# Altium schematic sheet Control_Sense_BOTTMOS V2.SchDoc (part 3 of 3)
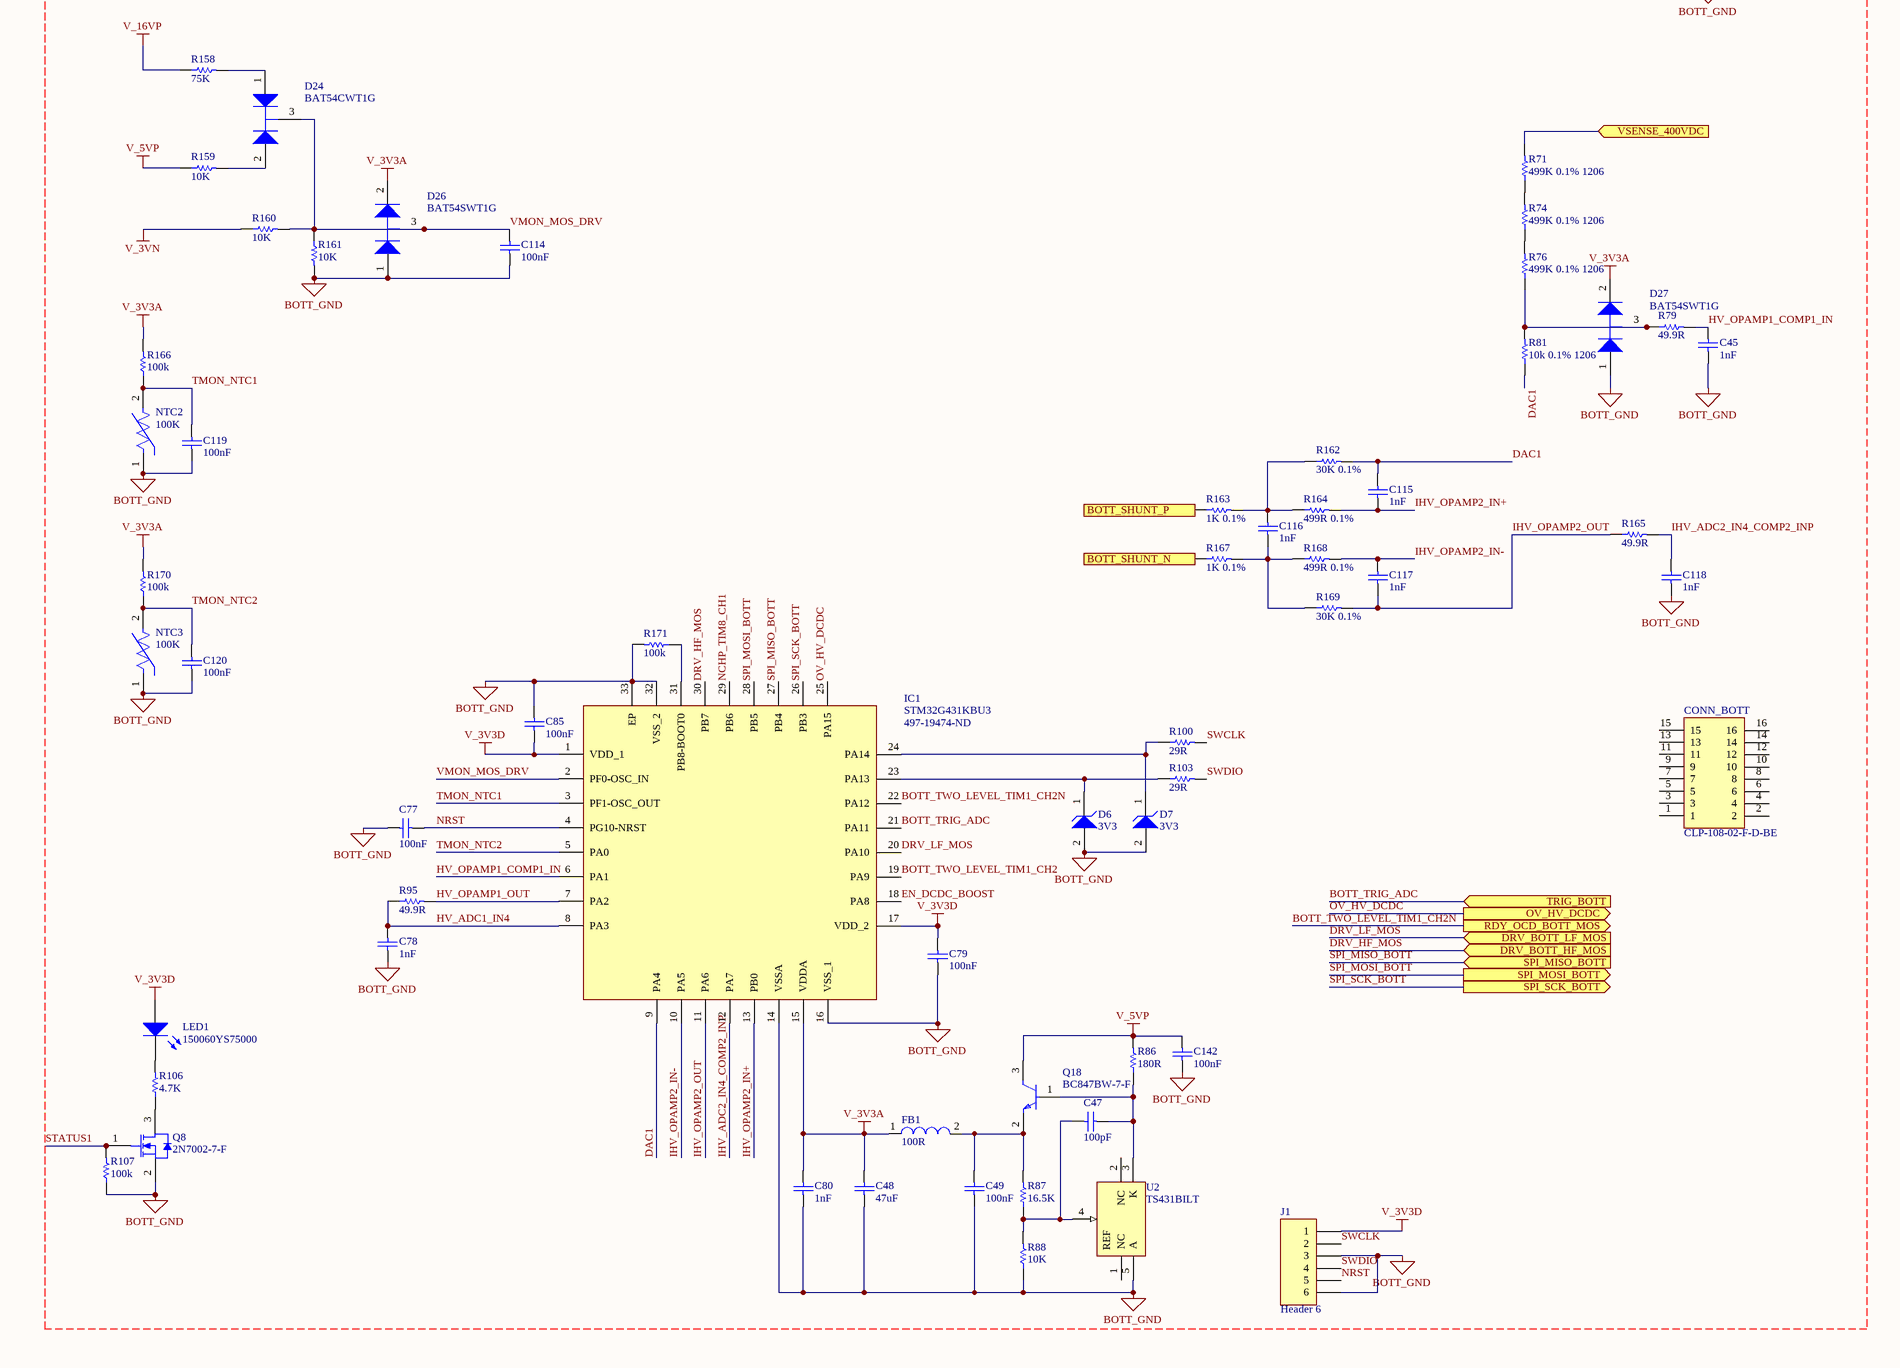
[diagram p3: Control_Sense_BOTTMOS V2.SchDoc, bottom]

## Library data of the parts (continued)
R71 R74 R76 = CMP-2003-02605-1: RES SMD 499K OHM 0.1% 1/4W 1206; Manufacturer: Susumu; Part Number: RG3216P-4993-B-T1; Resistance: 499kR; Temperature Coefficient: 25ppm/°C; Power Rating: 125mW; Voltage Rating: 150V; Max Power Dissipation: 250mW; Voltage Rating (DC): 200V; Supplier 1: Digi-Key; Supplier Part Number 1: RG32P499KBCT-ND; Manufacturer Part Number: RG3216P-4993-B-T1; RoHS: Yes; Category: Chip SMD Resistors; Stock 1: 248102; Pricing 1: 1=0.59000, 10=0.42000, 100=0.21840 (USD); Case/Package: 1206; Number of Pins: 2; Case Code (Imperial): 1206; Case Code (Metric): 3216; Min Operating Temperature: -55°C; Max Operating Temperature: 155°C; Tolerance: 0.1%; Packaging: Tape and Reel; Resistor Type: Thin Film; Package Quantity: 1; Number of Terminations: 2; Series: RG; Termination: SMD/SMT; Features: Automotive AEC-Q200; Length: 0.126inch; Width: 1.6mm; Height: 0.02inch; RoHS Compliant: Yes; Lead Free: Lead Free; ComponentLink1URL: https://datasheet.ciiva.com/12763/rg-rm-rgh-datasheet-12763879.pdf?src-supplier=Mouser; ComponentLink1Description: https://datasheet.ciiva.com/12763/rg-rm-rgh-datasheet-12763879.pdf?src-supplier=Mouser; ComponentLink2URL: https://datasheet.ciiva.com/2490/rg-rm-rgh-datasheet-2490491.pdf?src-supplier=Digi-Key; ComponentLink2Description: https://datasheet.ciiva.com/2490/rg-rm-rgh-datasheet-2490491.pdf?src-supplier=Digi-Key; ComponentLink3URL: https://datasheet.ciiva.com/2490/rg-rm-rgh-datasheet-2490492.pdf?src-supplier=Digi-Key; ComponentLink3Description: https://datasheet.ciiva.com/2490/rg-rm-rgh-datasheet-2490492.pdf?src-supplier=Digi-Key; ComponentLink4URL: https://datasheet.ciiva.com/2490/rg-rm-rgh-datasheet-2490493.pdf?src-supplier=Digi-Key; ComponentLink4Description: https://datasheet.ciiva.com/2490/rg-rm-rgh-datasheet-2490493.pdf?src-supplier=Digi-Key
R79 R95 R165 = CMP-2002-00969-1: Manufacturer: Panasonic; Part Number: ERJ-2RKF49R9X
R81 = CMP-2003-02667-1: Manufacturer: Susumu; Part Number: RG3216P-1002-B-T5
R85 R86 = CMP-2000-06929-1: Chip Resistor, 180 Ohm, +/- 1%, 0.1 W, -55 to 155 degC, 0603 (1608 Metric), RoHS, Tape and Reel; Manufacturer: Yageo; Manufacturer Part Number: RC0603FR-07180RL; Voltage Rating: 50V; Power Rating: 100mW; Resistance: 180Ohms; Temperature Coefficient: 100PPM/C; Package Reference: 0603; Package Description: 2-Pin Surface Mount Device, Body 1.6 x 0.8 mm; Case Code - mm: 1608; Mounting Technology: SurfaceMount; Packaging: Reel; Tolerance: 1%; Manufacturer URL: http://www.yageo.com/; Series: RC; Operating Temperature Range: -55Cto+155C; Product: ThickFilmResistorsGeneralPurpose; Termination Style: SMD/SMT; Case Code - in: 0603; Datasheet Version: Rev. 7, 05/2017; Datasheet URL: http://www.yageo.com/documents/recent/PYu-RC_Group_51_RoHS_L_7.pdf; Supplier 1: Future Electronics; Supplier Part Number 1: 5678388; RoHS: Yes; Category: Chip SMD Resistors; Stock 1: 722469; Pricing 1: 1=0.00940, 50=0.00570, 100=0.00520, 500=0.00430, 1500=0.00370 (USD); Case/Package: 0603; Number of Pins: 2; Case Code (Metric): 1608; Case Code (Imperial): 0603; Size Code: 0603; Min Operating Temperature: -55°C; Max Operating Temperature: 155°C; Resistor Type: Thick Film; Number of Terminations: 2; Termination: SMD/SMT; Max Power Dissipation: 100mW; Package Quantity: 1; Voltage Rating (DC): 50V; Resistance Tolerance: 1%; Features: Moisture Resistant; Construction: Rectangular; Length: 1.6mm; Width: 0.8mm; Height: 0.022inch; Depth: 0.8mm; RoHS Compliant: Yes; REACH SVHC: Unknown; Military Standard: Not; Lead Free: Lead Free; ComponentLink1URL: https://datasheet.ciiva.com/2454/pyu-r-int-thick-7-2454468.pdf?src-supplier=Digi-Key; ComponentLink1Description: https://datasheet.ciiva.com/2454/pyu-r-int-thick-7-2454468.pdf?src-supplier=Digi-Key; ComponentLink2URL: https://datasheet.ciiva.com/2454/pyu-r-int-thick-7-2454469.pdf?src-supplier=Digi-Key; ComponentLink2Description: https://datasheet.ciiva.com/2454/pyu-r-int-thick-7-2454469.pdf?src-supplier=Digi-Key; ComponentLink3URL: https://datasheet.ciiva.com/2454/pyu-r-int-thick-7-2454470.pdf?src-supplier=Digi-Key; ComponentLink3Description: https://datasheet.ciiva.com/2454/pyu-r-int-thick-7-2454470.pdf?src-supplier=Digi-Key; ComponentLink4URL: https://datasheet.ciiva.com/15189/getdatasheetpartid-325160-15189622.pdf?src-supplier=Verical; ComponentLink4Description: https://datasheet.ciiva.com/15189/getdatasheetpartid-325160-15189622.pdf?src-supplier=Verical; ComponentLink5URL: https://datasheet.ciiva.com/7746/443971-7746266.pdf?src-supplier=Element14; ComponentLink5Description: https://datasheet.ciiva.com/7746/443971-7746266.pdf?src-supplier=Element14; ComponentLink6URL: https://datasheet.ciiva.com/7746/443971-7746267.pdf?src-supplier=Element14; ComponentLink6Description: https://datasheet.ciiva.com/7746/443971-7746267.pdf?src-supplier=Element14
R87 R99 = CMP-2000-00279-1: RES, 16K5, 1%, 0.1W, 0603, THICK FILM; Manufacturer: Panasonic; Part Number: ERJ-3EKF1652V; Manufacturer Part Number: ERJ3EKF1652V; Resistance: 16.5kR; Temperature Coefficient: 100ppm/°C; Voltage Rating (DC): 50V; Power Rating: 100mW; Voltage Rating: 75V; Supplier 1: Digi-Key; Supplier Part Number 1: P16.5KHCT-ND; RoHS: Yes; Category: Chip SMD Resistors; Stock 1: 32109; Pricing 1: 1=0.10000, 10=0.05900, 100=0.02400, 1000=0.01079, 2500=0.00936 (USD); Mount: Surface Mount; Case/Package: 0603; Case Code (Metric): 1608; Case Code (Imperial): 0603; Contact Plating: Tin; Min Operating Temperature: -55°C; Max Operating Temperature: 155°C; Packaging: Tape and Reel; Tolerance: 1%; Resistor Type: Thick Film; Number of Terminations: 2; Max Power Dissipation: 100mW; Series: ERJ; Package Quantity: 5000; Termination: SMD/SMT; Features: Automotive AEC-Q200; Resistance Tolerance: 1%; Construction: Rectangular; Length: 1.6mm; Width: 0.031inch; Height: 0.022inch; Depth: 0.8mm; Radiation Hardening: No; RoHS Compliant: Yes; Lead Free: Lead Free; REACH SVHC: Unknown; Military Standard: Not; ComponentLink1URL: https://datasheet.ciiva.com/34303/1987679-34303576.pdf?src-supplier=Jameco; ComponentLink1Description: https://datasheet.ciiva.com/34303/1987679-34303576.pdf?src-supplier=Jameco; ComponentLink2URL: https://datasheet.ciiva.com/28695/1678782-28695960.pdf?src-supplier=Element14; ComponentLink2Description: https://datasheet.ciiva.com/28695/1678782-28695960.pdf?src-supplier=Element14; ComponentLink3URL: https://datasheet.ciiva.com/46389/426256-46389224.pdf?src-supplier=Element14; ComponentLink3Description: https://datasheet.ciiva.com/46389/426256-46389224.pdf?src-supplier=Element14; ComponentLink4URL: https://datasheet.ciiva.com/48531/aoa0000ce2-48531052.pdf?src-supplier=Avnet; ComponentLink4Description: https://datasheet.ciiva.com/48531/aoa0000ce2-48531052.pdf?src-supplier=Avnet; ComponentLink5URL: https://datasheet.ciiva.com/9192/aoa0000ce2-9192686.pdf?src-supplier=Avnet; ComponentLink5Description: https://datasheet.ciiva.com/9192/aoa0000ce2-9192686.pdf?src-supplier=Avnet; ComponentLink6URL: https://datasheet.ciiva.com/16767/70260748-16767022.pdf?src-supplier=Allied+Electronics; ComponentLink6Description: https://datasheet.ciiva.com/16767/70260748-16767022.pdf?src-supplier=Allied+Electronics
R88 R104 = CMP-1012-00623-3: Chip Resistor, 10 KOhm, +/- 1%, 0.1 W, -55 to 155 degC, 0603 (1608 Metric), RoHS, Tape and Reel; Manufacturer: Panasonic; Manufacturer Part Number: ERJ-3EKF1002V; Voltage Rating: 75V; Case\/Package: 0603; Power Rating: 100mW; Resistance: 10KOhm; Temperature Coefficient: 100ppm\/degreesC; Number of Pins: 2; Package Reference: 603; Depth: 0.8mm; Mount: SurfaceMount; Package Description: 2-Pin Surface Mount Device, Body 1.6 x 0.85 mm; Datasheet Version: 02/2017; Length: 1.6mm; Lead Free: LeadFree; Height: 0.45mm; Number of Terminations: 2; Max Power Dissipation: 100mW; Min Operating Temperature: -55degC; Datasheet URL: https://industrial.panasonic.com/cdbs/www-data/pdf/RDA0000/AOA0000C304.pdf; Termination: SMD/SMT; Case Code (Metric): 1608; Case Code (Imperial): 0603; Tolerance: 1%; Max Operating Temperature: 155degC; RoHSCompliant: true; Voltage Rating (DC): 75V; Radiation Hardening: No; Packaging: TapeandReel; Composition: ThickFilm; Mounting Technology: SurfaceMount; Manufacturer URL: http://www.panasonic.com/; Width: 0.031inch; REACH SVHC: NoSVHC; Contact Plating: Tin; Military Standard: Not; Package Quantity: 1; Supplier 1: Newark; Supplier Part Number 1: 85Y8500; RoHS: Yes; Category: Chip SMD Resistors; Stock 1: 35659; Pricing 1: 10=0.60200, 25=0.39200, 50=0.27700, 100=0.15700, 250=0.13200, 500=0.10200, 1000=0.06200 (USD); Case/Package: 0603; Size Code: 0603; Series: ERJ; Resistance Tolerance: 1%; Resistor Type: Thick Film; Construction: Rectangular; Features: Automotive AEC-Q200; Technology: THICK FILM; RoHS Compliant: Yes; ComponentLink1URL: https://datasheet.ciiva.com/16511/aoa0000ce2-16511861.pdf?src-supplier=Avnet+Asia; ComponentLink1Description: https://datasheet.ciiva.com/16511/aoa0000ce2-16511861.pdf?src-supplier=Avnet+Asia; ComponentLink2URL: https://datasheet.ciiva.com/46372/1678782-46372725.pdf?src-supplier=Element14; ComponentLink2Description: https://datasheet.ciiva.com/46372/1678782-46372725.pdf?src-supplier=Element14; ComponentLink3URL: https://datasheet.ciiva.com/28514/426256-28514198.pdf?src-supplier=Element14; ComponentLink3Description: https://datasheet.ciiva.com/28514/426256-28514198.pdf?src-supplier=Element14; ComponentLink4URL: https://datasheet.ciiva.com/9194/aoa0000ce2-9194199.pdf?src-supplier=Avnet; ComponentLink4Description: https://datasheet.ciiva.com/9194/aoa0000ce2-9194199.pdf?src-supplier=Avnet; ComponentLink5URL: https://datasheet.ciiva.com/7830/aoa0000ce2-7830729.pdf?src-supplier=Element14; ComponentLink5Description: https://datasheet.ciiva.com/7830/aoa0000ce2-7830729.pdf?src-supplier=Element14; ComponentLink6URL: https://datasheet.ciiva.com/17212/aoa0000ce2-17212105.pdf?src-supplier=Avnet+Europe; ComponentLink6Description: https://datasheet.ciiva.com/17212/aoa0000ce2-17212105.pdf?src-supplier=Avnet+Europe; ComponentLink7URL: https://datasheet.ciiva.com/30208/aoa0000ce2-30208985.pdf?src-supplier=Onlinecomponents.com; ComponentLink7Description: https://datasheet.ciiva.com/30208/aoa0000ce2-30208985.pdf?src-supplier=Onlinecomponents.com; ComponentLink8URL: https://datasheet.ciiva.com/48530/aoa0000ce2-48530988.pdf?src-supplier=Avnet; ComponentLink8Description: https://datasheet.ciiva.com/48530/aoa0000ce2-48530988.pdf?src-supplier=Avnet; ComponentLink9URL: https://datasheet.ciiva.com/24070/aoa0000ce2-24070318.pdf?src-supplier=Mouser; ComponentLink9Description: https://datasheet.ciiva.com/24070/aoa0000ce2-24070318.pdf?src-supplier=Mouser; ComponentLink10URL: https://datasheet.ciiva.com/16759/70260748-16759807.pdf?src-supplier=Allied+Electronics; ComponentLink10Description: https://datasheet.ciiva.com/16759/70260748-16759807.pdf?src-supplier=Allied+Electronics
R100 R103 R125 R126 R159-R161 = CMP-2000-01851-1: RK73B1JTTD103J; Manufacturer: KOA Speer; Resistance: 10kR; Tolerance: 5%; Power Rating: 100mW; Temperature Coefficient: 200ppm/°C; Voltage Rating: 50V; Part Number: RK73B1JTTD103J; Supplier 1: Digi-Key; Supplier Part Number 1: 2019-RK73B1JTTD103JCT-ND; Manufacturer Part Number: RK73B1JTTD103J; Stock 1: 652898; Pricing 1: 1=0,10000, 10=0,01500, 100=0,00610, 1000=0,00275, 2500=0,00239 (USD); RoHS: Yes; Case/Package: 0603; Number of Pins: 2; Case Code (Imperial): 0603; Case Code (Metric): 1608; Min Operating Temperature: -55°C; Max Operating Temperature: 155°C; Packaging: Tape and Reel; Composition: Thick Film; Termination: SMD/SMT; Military Standard: Not; Package Quantity: 5000; Voltage Rating (DC): 50V; Length: 1.6mm; Height: 0.45mm; Depth: 0.8mm; Width: 0.8mm; Lead Free: Lead Free; ComponentLink1URL: https://datasheet.ciiva.com/34302/1877832-34302947.pdf?src-supplier=Jameco; ComponentLink1Description: https://datasheet.ciiva.com/34302/1877832-34302947.pdf?src-supplier=Jameco; ComponentLink2URL: https://datasheet.ciiva.com/5554/rk73b-5554408.pdf?src-supplier=Mouser; ComponentLink2Description: https://datasheet.ciiva.com/5554/rk73b-5554408.pdf?src-supplier=Mouser; ComponentLink3URL: https://datasheet.ciiva.com/7773/548635-7773278.pdf?src-supplier=Element14; ComponentLink3Description: https://datasheet.ciiva.com/7773/548635-7773278.pdf?src-supplier=Element14
R105 R108 R147 R149 = CMP-2002-01144-1: S, THICK FILM, 33K, 100mW, 1%, 0402, FULL REEL; Product Range:PANASONIC - ERJ Series; Resistance:33kohm; Power Rating:100mW; Resistance Tolerance:± 1%; Resistor Case Style:0402 ^1005 Metric]; Resistor Element Type:Thick Film; Part Number: ERJ2RKF3302X; Manufacturer Part Number: ERJ-2RKF3302X; Resistance: 33kR; Voltage Rating: 50V; Temperature Coefficient: 100ppm/°C; Manufacturer: Panasonic; Supplier 1: Digi-Key; Supplier Part Number 1: P33.0KLCT-ND; RoHS: Yes; Category: Chip SMD Resistors; Stock 1: 8872; Pricing 1: 1=0.10000, 10=0.02500, 100=0.01020, 1000=0.00457, 2500=0.00397, 5000=0.00328 (USD); Mount: Surface Mount; Case/Package: 0402; Number of Pins: 2; Case Code (Metric): 1005; Case Code (Imperial): 0402; Contact Plating: Tin; Min Operating Temperature: -55°C; Max Operating Temperature: 155°C; Packaging: Tape and Reel; Tolerance: 1%; Power Rating: 100mW; Termination: SMD/SMT; Resistor Type: Thick Film; Max Power Dissipation: 100mW; Number of Terminations: 2; Package Quantity: 1; Voltage Rating (DC): 50V; Features: Automotive AEC-Q200; Length: 1mm; Width: 0.02inch; Height: 0.35mm; Depth: 0.5mm; Radiation Hardening: No; Military Standard: Not; Lead Free: Lead Free; REACH SVHC: No SVHC; ComponentLink1URL: https://datasheet.ciiva.com/11821/0900766b80f80784-11821294.pdf?src-supplier=RSComponents; ComponentLink1Description: https://datasheet.ciiva.com/11821/0900766b80f80784-11821294.pdf?src-supplier=RSComponents; ComponentLink2URL: https://datasheet.ciiva.com/16784/70260748-16784773.pdf?src-supplier=Allied+Electronics; ComponentLink2Description: https://datasheet.ciiva.com/16784/70260748-16784773.pdf?src-supplier=Allied+Electronics; ComponentLink3URL: https://datasheet.ciiva.com/22673/1678782-22673685.pdf?src-supplier=Element14; ComponentLink3Description: https://datasheet.ciiva.com/22673/1678782-22673685.pdf?src-supplier=Element14; ComponentLink4URL: https://datasheet.ciiva.com/22737/426256-22737285.pdf?src-supplier=Element14; ComponentLink4Description: https://datasheet.ciiva.com/22737/426256-22737285.pdf?src-supplier=Element14; ComponentLink5URL: https://datasheet.ciiva.com/30159/aoa0000ce2-30159014.pdf?src-supplier=Onlinecomponents.com; ComponentLink5Description: https://datasheet.ciiva.com/30159/aoa0000ce2-30159014.pdf?src-supplier=Onlinecomponents.com; ComponentLink6URL: https://datasheet.ciiva.com/9190/aoa0000ce2-9190679.pdf?src-supplier=Avnet; ComponentLink6Description: https://datasheet.ciiva.com/9190/aoa0000ce2-9190679.pdf?src-supplier=Avnet; ComponentLink7URL: https://datasheet.ciiva.com/17210/aoa0000ce2-17210312.pdf?src-supplier=Avnet+Europe; ComponentLink7Description: https://datasheet.ciiva.com/17210/aoa0000ce2-17210312.pdf?src-supplier=Avnet+Europe; ComponentLink8URL: https://datasheet.ciiva.com/7802/aoa0000ce2-7802409.pdf?src-supplier=Element14; ComponentLink8Description: https://datasheet.ciiva.com/7802/aoa0000ce2-7802409.pdf?src-supplier=Element14; ComponentLink9URL: https://datasheet.ciiva.com/46420/1678782-46420317.pdf?src-supplier=Element14; ComponentLink9Description: https://datasheet.ciiva.com/46420/1678782-46420317.pdf?src-supplier=Element14; ComponentLink10URL: https://datasheet.ciiva.com/24024/aoa0000ce2-24024398.pdf?src-supplier=Mouser; ComponentLink10Description: https://datasheet.ciiva.com/24024/aoa0000ce2-24024398.pdf?src-supplier=Mouser; ComponentLink11URL: https://datasheet.ciiva.com/22687/1678782-22687071.pdf?src-supplier=Element14; ComponentLink11Description: https://datasheet.ciiva.com/22687/1678782-22687071.pdf?src-supplier=Element14
R106 = CMP-1659-00035-1: General Purpose Chip Resistor, 470 Ohm, +/- 1%, -55 to 155 degC, 0603 (1608 Metric), RoHS, Tape and Reel; Manufacturer: Yageo; Manufacturer Part Number: RC0603FR-07470RL; Impedance: 50 Ohm; Power Rating: 100mW; Temperature Coefficient: 100ppm/°C; Voltage Rating: 50V; Working Voltage: 75V; Fastening Type: Snap; Min Operating Temperature: -40 degC; Length: 3 mm; PackageReference: 0603; Contact Material: Brass; Max Operating Temperature: 90 degC; ComponentLink2URL: https://datasheet.ciiva.com/11808/0900766b80f96399-11808177.pdf; Packaging: Tape and Reel; DatasheetVersion: Rev. 4, 04/2009; Contact Plating: Gold; Radiation Hardening: No; Height: 1.25 mm; Resistance: 50 Ohm; RoHSCompliant: true; ComponentLink2Description: Datasheet; Package Quantity: 2500; ComponentLink1URL: http://www.yageo.com/; Width: 3.1 mm; Mount: Surface Mount; PackageDescription: 2-Pin Surface Mount Device, Body 1.6 x 0.8 mm; ComponentLink1Description: Manufacturer URL; Supplier 1: Digi-Key; Supplier Part Number 1: 311-470HRCT-ND; RoHS: Yes; Category: Chip SMD Resistors; Stock 1: 4373564; Pricing 1: 1=0.10000, 10=0.02300, 100=0.00940, 1000=0.00421, 2500=0.00366 (USD); Case/Package: 0603; Case Code (Metric): 1608; Case Code (Imperial): 0603; Tolerance: 1%; Termination: SMD/SMT; Composition: Thick Film; Number of Terminations: 2; Max Power Dissipation: 100mW; Military Standard: Not; Features: Moisture Resistant; Depth: 0.8mm; REACH SVHC: No SVHC; Lead Free: Lead Free; ComponentLink3URL: https://datasheet.ciiva.com/11808/0900766b80f96399-11808177.pdf?src-supplier=RSComponents; ComponentLink3Description: https://datasheet.ciiva.com/11808/0900766b80f96399-11808177.pdf?src-supplier=RSComponents; ComponentLink4URL: https://datasheet.ciiva.com/7660/1868787-7660793.pdf?src-supplier=Element14; ComponentLink4Description: https://datasheet.ciiva.com/7660/1868787-7660793.pdf?src-supplier=Element14; ComponentLink5URL: https://datasheet.ciiva.com/46440/1868787-46440907.pdf?src-supplier=Element14; ComponentLink5Description: https://datasheet.ciiva.com/46440/1868787-46440907.pdf?src-supplier=Element14; ComponentLink6URL: https://datasheet.ciiva.com/2454/pyu-r-int-thick-7-2454014.pdf?src-supplier=Digi-Key; ComponentLink6Description: https://datasheet.ciiva.com/2454/pyu-r-int-thick-7-2454014.pdf?src-supplier=Digi-Key; ComponentLink7URL: https://datasheet.ciiva.com/7746/1738695-7746359.pdf?src-supplier=Element14; ComponentLink7Description: https://datasheet.ciiva.com/7746/1738695-7746359.pdf?src-supplier=Element14; ComponentLink8URL: https://datasheet.ciiva.com/7746/1738695-7746360.pdf?src-supplier=Element14; ComponentLink8Description: https://datasheet.ciiva.com/7746/1738695-7746360.pdf?src-supplier=Element14; ComponentLink9URL: https://datasheet.ciiva.com/2454/pyu-r-int-thick-7-2454012.pdf?src-supplier=Digi-Key; ComponentLink9Description: https://datasheet.ciiva.com/2454/pyu-r-int-thick-7-2454012.pdf?src-supplier=Digi-Key; ComponentLink10URL: https://datasheet.ciiva.com/2454/pyu-r-int-thick-7-2454013.pdf?src-supplier=Digi-Key; ComponentLink10Description: https://datasheet.ciiva.com/2454/pyu-r-int-thick-7-2454013.pdf?src-supplier=Digi-Key
R107 = CMP-2000-06953-1: General Purpose Chip Resistor, 1 MOhm, +/- 5%, -55 to 155 degC, 0603 (1608 Metric), RoHS, Tape and Reel; Manufacturer: Yageo; Manufacturer Part Number: RC0603JR-071ML; Power Rating: 100mW; Product Range: RCSeries; Temperature Coefficient: ±100ppm/°C; Resistor Element Type: ThickFilm; Resistance: 1Mohm; SVHC: ToBeAdvised; Voltage Rating: 50V; Resistor Case Style: 0603[1608Metric]; MSL: MSL1-Unlimited; Package Description: 2-Pin Surface Mount Device, Body 1.6 x 0.8 mm; Resistance Tolerance: ±5%; Datasheet Version: Rev. 7, 05/2017; Datasheet URL: http://www.yageo.com/documents/recent/PYu-RC_Group_51_RoHS_L_7.pdf; Manufacturer URL: http://www.yageo.com/; Package Reference: 0603; Automotive Qualification Standard: -; Packaging: CutTape; Mounting Technology: SurfaceMount; Supplier 1: Digi-Key; Supplier Part Number 1: 311-1.0MGRCT-ND; Stock 1: 3949362; Pricing 1: 1=0,10000, 10=0,01900, 100=0,00770, 1000=0,00347, 2500=0,00301 (USD); RoHS: Yes; Case/Package: 0603; Number of Pins: 2; Case Code (Imperial): 0603; Case Code (Metric): 1608; Contact Plating: Tin,Matte; Min Operating Temperature: -55°C; Max Operating Temperature: 155°C; Tolerance: 5%; Composition: Thick Film; Termination: SMD/SMT; Package Quantity: 5000; Military Standard: Not; Voltage Rating (DC): 50V; Length: 1.6mm; Height: 0.45mm; Width: 0.8mm; Depth: 0.8mm; Radiation Hardening: No; Lead Free: Lead Free; REACH SVHC: No SVHC; ComponentLink1URL: https://datasheet.ciiva.com/46395/443971-46395067.pdf?src-supplier=Element14; ComponentLink1Description: https://datasheet.ciiva.com/46395/443971-46395067.pdf?src-supplier=Element14; ComponentLink2URL: https://datasheet.ciiva.com/8883/pyu-rc0603-51-rohs-l-4-8883053.pdf?src-supplier=Avnet; ComponentLink2Description: https://datasheet.ciiva.com/8883/pyu-rc0603-51-rohs-l-4-8883053.pdf?src-supplier=Avnet; ComponentLink3URL: https://datasheet.ciiva.com/12555/rc0603-272842-12555342.pdf?src-supplier=Mouser; ComponentLink3Description: https://datasheet.ciiva.com/12555/rc0603-272842-12555342.pdf?src-supplier=Mouser; ComponentLink4URL: https://datasheet.ciiva.com/7746/443971-7746463.pdf?src-supplier=Element14; ComponentLink4Description: https://datasheet.ciiva.com/7746/443971-7746463.pdf?src-supplier=Element14
R121 R122 R154 R157 R166 R170 R171 = CMP-2000-00182-1: Res Thick Film 0603 100K Ohm 1% 0.1W(1/10W) ±100ppm/C Pad SMD Automotive T/R; Part Number: ERJ-3EKF1003V; Manufacturer: Panasonic; Manufacturer Part Number: ERJ3EKF1003V; Resistance: 100kR; Power Rating: 100mW; Temperature Coefficient: 100ppm/°C; Voltage Rating: 75V; Supplier 1: Digi-Key; Supplier Part Number 1: P100KHCT-ND; RoHS: Yes; Category: Chip SMD Resistors; Stock 1: 2532776; Pricing 1: 1=0.10000, 10=0.05700, 100=0.02340, 1000=0.01049, 2500=0.00911 (USD); Mount: Surface Mount; Case/Package: 0603; Number of Pins: 2; Weight: 7.1E-05oz; Case Code (Imperial): 0603; Case Code (Metric): 1608; Contact Plating: Tin; Min Operating Temperature: -55°C; Max Operating Temperature: 155°C; Tolerance: 1%; Packaging: Tape and Reel; Composition: Thick Film; Termination: SMD/SMT; Package Quantity: 5000; Number of Terminations: 2; Max Power Dissipation: 100mW; Military Standard: Not; Voltage Rating (DC): 75V; Features: Automotive AEC-Q200; Length: 1.6mm; Height: 0.022inch; Width: 0.8mm; Depth: 0.8mm; Radiation Hardening: No; Lead Free: Lead Free; REACH SVHC: No SVHC; ComponentLink1URL: https://datasheet.ciiva.com/34303/1987476-34303566.pdf?src-supplier=Jameco; ComponentLink1Description: https://datasheet.ciiva.com/34303/1987476-34303566.pdf?src-supplier=Jameco; ComponentLink2URL: https://datasheet.ciiva.com/30133/aoa0000ce2-30133845.pdf?src-supplier=Onlinecomponents.com; ComponentLink2Description: https://datasheet.ciiva.com/30133/aoa0000ce2-30133845.pdf?src-supplier=Onlinecomponents.com; ComponentLink3URL: https://datasheet.ciiva.com/15158/getdatasheetpartid-247527-15158907.pdf?src-supplier=Verical; ComponentLink3Description: https://datasheet.ciiva.com/15158/getdatasheetpartid-247527-15158907.pdf?src-supplier=Verical; ComponentLink4URL: https://datasheet.ciiva.com/16770/70260748-16770253.pdf?src-supplier=Allied+Electronics; ComponentLink4Description: https://datasheet.ciiva.com/16770/70260748-16770253.pdf?src-supplier=Allied+Electronics; ComponentLink5URL: https://datasheet.ciiva.com/16740/aoa0000ce2-16740662.pdf?src-supplier=Future+Electronics; ComponentLink5Description: https://datasheet.ciiva.com/16740/aoa0000ce2-16740662.pdf?src-supplier=Future+Electronics; Supplier 2: Newark; Supplier Part Number 2: 85Y8503; Stock 2: 3015148; Pricing 2: 5000=0.02500, 10000=0.02400, 20000=0.01800 (USD); Size Code: 0603; Resistor Type: Thick Film; Series: ERJ; Resistance Tolerance: 1%; Construction: Rectangular; RoHS Compliant: Yes
R123 R127 R128 R145 R146 R153 R156 = CMP-1659-00020-2: Chip Resistor, 330 Ohm, +/- 1%, 0.1 W, -55 to 155 degC, 0603 (1608 Metric), RoHS, Tape and Reel; Tolerance: 10%; ESR: 800 mohm; Voltage Rating (DC): 16 V; Capacitance: 47 uF; Length: 7.3 mm; ComponentLink1URL: http://www.yageo.com/; Packaging: Tape and Reel; Pins: 2; ComponentLink1Description: Manufacturer URL; Case Code (Imperial): 2917; REACH SVHC: No SVHC; Width: 4.3 mm; ComponentLink2Description: Datasheet; Voltage Rating: 16 V; RoHSCompliant: True; Max Operating Temperature: 125degC; ComponentLink2URL: http://www.yageo.com/documents/recent/PYu-RC_Group_51_RoHS_L_04.pdf; Min Operating Temperature: -55degC; Case/Package: 2917; Radiation Hardening: No; DatasheetVersion: Rev. 4, 02/2016; Mount: Surface Mount; PackageReference: 0603; Package Quantity: 500; Case Code (Metric): 7343; PackageDescription: 2-Pin Surface Mount Device, Body 1.6 x 0.8 mm; Height: 3.1 mm
R124 = CMP-2000-06934-1: Thick Film Resistor, 2.2 KOhm, 100 mW, 50 V, +/- 1%, -55 to 155 degC, 2-Pin SMD (0603), RoHS, Tape and Reel; Manufacturer: Yageo; Manufacturer Part Number: RC0603FR-072K2L; Resistance: 2.2kOhms; Temperature Coefficient: 100PPM/C; Voltage Rating: 50V; Power Rating: 100mW; Tolerance: 1%; Datasheet Version: Rev. 7, 05/2017; Case Code - mm: 1608; Series: RC; Mounting Technology: SurfaceMount; Package Description: 2-Pin Surface Mount Device, Body 1.6 x 0.8 mm; Case Code - in: 0603; Package Reference: 0603; Product: ThickFilmResistorsGeneralPurpose; Manufacturer URL: http://www.yageo.com/; Termination Style: SMD/SMT; Operating Temperature Range: -55Cto+155C; Datasheet URL: http://www.yageo.com/documents/recent/PYu-RC_Group_51_RoHS_L_7.pdf; Packaging: Reel; Supplier 1: Newark; Supplier Part Number 1: 98K7376; RoHS: Yes; Category: Chip SMD Resistors; Case/Package: 0603; Case Code (Imperial): 0603; Case Code (Metric): 1608; Size Code: 0603; Min Operating Temperature: -55°C; Max Operating Temperature: 155°C; Package Quantity: 1; Termination: SMD/SMT; Max Power Dissipation: 100mW; Resistor Type: Thick Film; Number of Terminations: 2; Resistance Tolerance: 1%; Construction: Rectangular; Features: Moisture Resistant; Length: 1.6mm; Width: 0.031inch; Height: 0.022inch; Depth: 0.8mm; REACH SVHC: No SVHC; Military Standard: Not; Lead Free: Lead Free; RoHS Compliant: Yes; ComponentLink1URL: https://datasheet.ciiva.com/2453/pyu-r-int-thick-7-2453943.pdf?src-supplier=Digi-Key; ComponentLink1Description: https://datasheet.ciiva.com/2453/pyu-r-int-thick-7-2453943.pdf?src-supplier=Digi-Key; ComponentLink2URL: https://datasheet.ciiva.com/2453/pyu-r-int-thick-7-2453944.pdf?src-supplier=Digi-Key; ComponentLink2Description: https://datasheet.ciiva.com/2453/pyu-r-int-thick-7-2453944.pdf?src-supplier=Digi-Key; ComponentLink3URL: https://datasheet.ciiva.com/2453/pyu-r-int-thick-7-2453945.pdf?src-supplier=Digi-Key; ComponentLink3Description: https://datasheet.ciiva.com/2453/pyu-r-int-thick-7-2453945.pdf?src-supplier=Digi-Key; ComponentLink4URL: https://datasheet.ciiva.com/7660/1868787-7660791.pdf?src-supplier=Element14; ComponentLink4Description: https://datasheet.ciiva.com/7660/1868787-7660791.pdf?src-supplier=Element14; ComponentLink5URL: https://datasheet.ciiva.com/46394/443971-46394958.pdf?src-supplier=Element14; ComponentLink5Description: https://datasheet.ciiva.com/46394/443971-46394958.pdf?src-supplier=Element14; ComponentLink6URL: https://datasheet.ciiva.com/46440/1868787-46440902.pdf?src-supplier=Element14; ComponentLink6Description: https://datasheet.ciiva.com/46440/1868787-46440902.pdf?src-supplier=Element14; ComponentLink7URL: https://datasheet.ciiva.com/7746/1738695-7746316.pdf?src-supplier=Element14; ComponentLink7Description: https://datasheet.ciiva.com/7746/1738695-7746316.pdf?src-supplier=Element14; ComponentLink8URL: https://datasheet.ciiva.com/7746/1738695-7746315.pdf?src-supplier=Element14; ComponentLink8Description: https://datasheet.ciiva.com/7746/1738695-7746315.pdf?src-supplier=Element14
R138 R144 R148 R150 R151 R155 = RES_EMPTY_0805: Resistor, 0805 SMD, Empty footprint; Value: N/A; Package / Case: 0805 (2012 metric)
R158 = CMP-2000-00637-1: Part Number: ERJ-3EKF7502V; Manufacturer: Panasonic; Resistance: 75kR; Tolerance: 1%; Power Rating: 100mW; Temperature Coefficient: 100ppm/°C; Voltage Rating (DC): 50V; Voltage Rating: 75V; Supplier 1: Digi-Key; Supplier Part Number 1: P75.0KHCT-ND; Manufacturer Part Number: ERJ-3EKF7502V; RoHS: Yes; Category: Chip SMD Resistors; Stock 1: 127703; Pricing 1: 1=0.10000, 10=0.06000, 100=0.02450, 1000=0.01100, 2500=0.00955 (USD); Mount: Surface Mount; Case/Package: 0603; Case Code (Metric): 1608; Case Code (Imperial): 0603; Contact Plating: Tin; Min Operating Temperature: -55°C; Max Operating Temperature: 155°C; Packaging: Tape and Reel; Resistor Type: Thick Film; Number of Terminations: 2; Max Power Dissipation: 100mW; Series: ERJ; Package Quantity: 1; Construction: Rectangular; Resistance Tolerance: 1%; Termination: SMD/SMT; Features: Automotive AEC-Q200; Technology: THICK FILM; Length: 1.6mm; Width: 0.031inch; Height: 0.45mm; Depth: 0.8mm; Radiation Hardening: No; RoHS Compliant: Yes; Military Standard: Not; Lead Free: Lead Free; REACH SVHC: No SVHC; ComponentLink1URL: https://datasheet.ciiva.com/34303/1988401-34303605.pdf?src-supplier=Jameco; ComponentLink1Description: https://datasheet.ciiva.com/34303/1988401-34303605.pdf?src-supplier=Jameco; ComponentLink2URL: https://datasheet.ciiva.com/9187/aoa0000ce2-9187719.pdf?src-supplier=Avnet; ComponentLink2Description: https://datasheet.ciiva.com/9187/aoa0000ce2-9187719.pdf?src-supplier=Avnet; ComponentLink3URL: https://datasheet.ciiva.com/24069/aoa0000ce2-24069064.pdf?src-supplier=Mouser; ComponentLink3Description: https://datasheet.ciiva.com/24069/aoa0000ce2-24069064.pdf?src-supplier=Mouser; ComponentLink4URL: https://datasheet.ciiva.com/28596/1678782-28596232.pdf?src-supplier=Element14; ComponentLink4Description: https://datasheet.ciiva.com/28596/1678782-28596232.pdf?src-supplier=Element14; ComponentLink5URL: https://datasheet.ciiva.com/15159/getdatasheetpartid-28812-15159210.pdf?src-supplier=Verical; ComponentLink5Description: https://datasheet.ciiva.com/15159/getdatasheetpartid-28812-15159210.pdf?src-supplier=Verical; ComponentLink6URL: https://datasheet.ciiva.com/31835/aoa0000ce2-31835674.pdf?src-supplier=Onlinecomponents.com; ComponentLink6Description: https://datasheet.ciiva.com/31835/aoa0000ce2-31835674.pdf?src-supplier=Onlinecomponents.com; ComponentLink7URL: https://datasheet.ciiva.com/28676/1678782-28676971.pdf?src-supplier=Element14; ComponentLink7Description: https://datasheet.ciiva.com/28676/1678782-28676971.pdf?src-supplier=Element14; ComponentLink8URL: https://datasheet.ciiva.com/46374/426256-46374235.pdf?src-supplier=Element14; ComponentLink8Description: https://datasheet.ciiva.com/46374/426256-46374235.pdf?src-supplier=Element14; ComponentLink9URL: https://datasheet.ciiva.com/48531/aoa0000ce2-48531550.pdf?src-supplier=Avnet; ComponentLink9Description: https://datasheet.ciiva.com/48531/aoa0000ce2-48531550.pdf?src-supplier=Avnet
R162 R169 = RES: Resistor, SMD 30 kOhm 0603  ±  0.1 %, ERA3AEB303V, Panasonic Automotive & Industrial Systems; Manufacturer Part Number: ERA-3AEB303V; Power Rating: 100mW; Voltage Rating: 75V; Resistance: 30kR; Temperature Coefficient: 25ppm/°C; Manufacturer: Panasonic; Part Number: ERA3AEB303V; Supplier 1: Avnet; Supplier Part Number 1: ERA-3AEB303V; RoHS: Yes; Category: Chip SMD Resistors; Stock 1: 26; Pricing 1: 1=0.03536, 157=0.03482, 313=0.03427, 625=0.03373, 1250=0.03318, 2500=0.03264, 5000=0.03210 (USD); Mount: Surface Mount; Case/Package: 0603; Number of Pins: 2; Case Code (Metric): 1608; Case Code (Imperial): 0603; Size Code: 0603; Contact Plating: Tin; Min Operating Temperature: -55°C; Max Operating Temperature: 155°C; Tolerance: 0.1%; Packaging: Tape and Reel; Resistor Type: Thin Film; Series: ERA-3A; Termination: SMD/SMT; Number of Terminations: 2; Max Power Dissipation: 100mW; Features: Automotive AEC-Q200; Package Quantity: 1; Resistance Tolerance: 0.1%; Construction: Rectangular; Technology: THIN FILM; Length: 1.6mm; Width: 0.8mm; Height: 0.45mm; Depth: 0.8mm; Radiation Hardening: No; RoHS Compliant: Yes; REACH SVHC: No SVHC; Military Standard: Not; ComponentLink1URL: https://datasheet.ciiva.com/29183/451408-da-01-en-widerstand-0603-era-29183835.pdf?src-supplier=Conrad; ComponentLink1Description: https://datasheet.ciiva.com/29183/451408-da-01-en-widerstand-0603-era-29183835.pdf?src-supplier=Conrad; ComponentLink2URL: https://datasheet.ciiva.com/5917/485442-5917669.pdf?src-supplier=Farnell; ComponentLink2Description: https://datasheet.ciiva.com/5917/485442-5917669.pdf?src-supplier=Farnell; ComponentLink3URL: https://datasheet.ciiva.com/16212/aoa0000ce26-16212101.pdf?src-supplier=Future+Electronics; ComponentLink3Description: https://datasheet.ciiva.com/16212/aoa0000ce26-16212101.pdf?src-supplier=Future+Electronics; ComponentLink4URL: https://datasheet.ciiva.com/43455/485442-43455381.pdf?src-supplier=Farnell; ComponentLink4Description: https://datasheet.ciiva.com/43455/485442-43455381.pdf?src-supplier=Farnell; ComponentLink5URL: https://datasheet.ciiva.com/30073/54aoa0000ce26-30073910.pdf?src-supplier=Onlinecomponents.com; ComponentLink5Description: https://datasheet.ciiva.com/30073/54aoa0000ce26-30073910.pdf?src-supplier=Onlinecomponents.com; ComponentLink6URL: https://datasheet.ciiva.com/9190/aoa0000ce26-9190919.pdf?src-supplier=Avnet; ComponentLink6Description: https://datasheet.ciiva.com/9190/aoa0000ce26-9190919.pdf?src-supplier=Avnet; ComponentLink7URL: https://datasheet.ciiva.com/16759/70068849-16759447.pdf?src-supplier=Allied+Electronics; ComponentLink7Description: https://datasheet.ciiva.com/16759/70068849-16759447.pdf?src-supplier=Allied+Electronics; ComponentLink8URL: https://datasheet.ciiva.com/17210/aoa0000ce26-17210455.pdf?src-supplier=Avnet+Europe; ComponentLink8Description: https://datasheet.ciiva.com/17210/aoa0000ce26-17210455.pdf?src-supplier=Avnet+Europe; ComponentLink9URL: https://datasheet.ciiva.com/22740/485442-22740936.pdf?src-supplier=Element14; ComponentLink9Description: https://datasheet.ciiva.com/22740/485442-22740936.pdf?src-supplier=Element14; ComponentLink10URL: https://datasheet.ciiva.com/43457/485442-43457880.pdf?src-supplier=Farnell; ComponentLink10Description: https://datasheet.ciiva.com/43457/485442-43457880.pdf?src-supplier=Farnell; ComponentLink11URL: https://datasheet.ciiva.com/48425/era-eng-tds-48425453.pdf?src-supplier=Distrelec; ComponentLink11Description: https://datasheet.ciiva.com/48425/era-eng-tds-48425453.pdf?src-supplier=Distrelec
R163 R167 = CMP-2000-04525-1: RES SMD 1K OHM 0.1% 1/10W 0603; Part Number: RT0603BRE071KL; Manufacturer: Yageo; Resistance: 1kR; Power Rating: 100mW; Temperature Coefficient: 50ppm/°C; Voltage Rating (DC): 50V; Supplier 1: Digi-Key; Supplier Part Number 1: YAG2314CT-ND; Manufacturer Part Number: RT0603BRE071KL; RoHS: Yes; Category: Chip SMD Resistors; Stock 1: 173; Pricing 1: 1=0.38000, 10=0.27500, 100=0.11000, 1000=0.05420, 2500=0.05021 (USD); Case/Package: 0603; Case Code (Metric): 1608; Case Code (Imperial): 0603; Size Code: 0603; Min Operating Temperature: -55°C; Max Operating Temperature: 155°C; Packaging: Tape and Reel; Resistor Type: Thin Film; Tolerance: 0.1%; Number of Terminations: 2; Series: RT; Max Power Dissipation: 100mW; Construction: Rectangular; Package Quantity: 5000; Features: Moisture Resistant; Length: 0.063inch; Width: 0.031inch; Height: 0.022inch; Depth: 0.8mm; RoHS Compliant: Yes; Military Standard: Not; Lead Free: Lead Free; ComponentLink1URL: https://datasheet.ciiva.com/2584/pyu-rt-1-to-0-05-rohs-l-5-2584317.pdf?src-supplier=Digi-Key; ComponentLink1Description: https://datasheet.ciiva.com/2584/pyu-rt-1-to-0-05-rohs-l-5-2584317.pdf?src-supplier=Digi-Key
R164 R168 = RES: Res Thin Film 0603 499 Ohm 0.1% 1/10W ±25ppm/°C Molded SMD SMD Punched Carrier T/R; Part Number: ERA3AEB4990V; Manufacturer: Panasonic; Manufacturer Part Number: ERA-3AEB4990V; Power Rating: 100mW; Voltage Rating: 150V; Voltage Rating (DC): 75V; Supplier 1: Digi-Key; Supplier Part Number 1: P499DBCT-ND; RoHS: Yes; Category: Chip SMD Resistors; Stock 1: 51561; Pricing 1: 1=0.31000, 10=0.26000, 100=0.10150, 1000=0.04248, 2500=0.03894 (USD); Mount: Surface Mount; Case/Package: 0603; Number of Pins: 2; Case Code (Metric): 1608; Case Code (Imperial): 0603; Contact Plating: Tin; Min Operating Temperature: -55°C; Max Operating Temperature: 155°C; Resistance: 499R; Tolerance: 0.1%; Packaging: Tape and Reel; Resistor Type: Thin Film,Metal Film; Temperature Coefficient: 25ppm/°C; Package Quantity: 1; Number of Terminations: 2; Termination: SMD/SMT; Max Power Dissipation: 100mW; Series: ERA-3A; Resistance Tolerance: 0.1%; Construction: Rectangular; Features: Automotive AEC-Q200; Technology: METAL FILM; Length: 1.6mm; Width: 0.8mm; Height: 0.45mm; Depth: 0.8mm; Radiation Hardening: No; RoHS Compliant: Yes; Lead Free: Lead Free; REACH SVHC: No SVHC; Military Standard: Not; ComponentLink1URL: https://datasheet.ciiva.com/11810/0900766b80eb1d8c-11810911.pdf?src-supplier=RSComponents; ComponentLink1Description: https://datasheet.ciiva.com/11810/0900766b80eb1d8c-11810911.pdf?src-supplier=RSComponents; ComponentLink2URL: https://datasheet.ciiva.com/29183/451973-da-01-en-widerstand-0603-era-29183924.pdf?src-supplier=Conrad; ComponentLink2Description: https://datasheet.ciiva.com/29183/451973-da-01-en-widerstand-0603-era-29183924.pdf?src-supplier=Conrad; ComponentLink3URL: https://datasheet.ciiva.com/9181/aoa0000ce26-9181477.pdf?src-supplier=Avnet; ComponentLink3Description: https://datasheet.ciiva.com/9181/aoa0000ce26-9181477.pdf?src-supplier=Avnet; ComponentLink4URL: https://datasheet.ciiva.com/17205/aoa0000ce26-17205477.pdf?src-supplier=Avnet+Europe; ComponentLink4Description: https://datasheet.ciiva.com/17205/aoa0000ce26-17205477.pdf?src-supplier=Avnet+Europe; ComponentLink5URL: https://datasheet.ciiva.com/30161/54aoa0000ce26-30161593.pdf?src-supplier=Onlinecomponents.com; ComponentLink5Description: https://datasheet.ciiva.com/30161/54aoa0000ce26-30161593.pdf?src-supplier=Onlinecomponents.com; ComponentLink6URL: https://datasheet.ciiva.com/7920/485442-7920378.pdf?src-supplier=Element14; ComponentLink6Description: https://datasheet.ciiva.com/7920/485442-7920378.pdf?src-supplier=Element14; ComponentLink7URL: https://datasheet.ciiva.com/7920/485442-7920379.pdf?src-supplier=Element14; ComponentLink7Description: https://datasheet.ciiva.com/7920/485442-7920379.pdf?src-supplier=Element14; ComponentLink8URL: https://datasheet.ciiva.com/6201/485442-6201036.pdf?src-supplier=Farnell; ComponentLink8Description: https://datasheet.ciiva.com/6201/485442-6201036.pdf?src-supplier=Farnell
U2 U10 = CMP-0242-00042-1: 30mA, Low voltage adjustable shunt reference, 1.24 to 6V, 5-Pin SOT23-5, Tape and Reel; ComponentLink1URL: http://www.st.com; ComponentLink1Description: Manufacturer URL; ComponentLink2URL: http://www.st.com/internet/com/TECHNICAL_RESOURCES/TECHNICAL_LITERATURE/DATASHEET/CD00001336.pdf; PackageVersion: 2010; ComponentLink2Description: Datasheet; PackageReference: SOT23-5; PackageDescription: 5-Pin SOT-23 Package, 2.9 x 1.6 mm Body, 0.95 mm Pitch, 2.8 mm Lead Span; DatasheetVersion: Aug-2010
U3 U13 = 1EDN8550B: Single-channel EiceDRIVER™ with true  differential inputs
U11 U12 = CMP-0859-00394-3: Single 2-Input Positive-AND Gate, DCK0005A, SMALL T&R; Generic Part Number: SN74AHC1G08; Manufacturer: Texas Instruments; Schmitt Trigger: No; ICC @ Nom Voltage(Max)(mA): 0.01; Technology Family: AHC; Output Drive (IOL/IOH)(Max)(mA): 50/-50; tpd @ Nom Voltage(Max)(ns): 12.3,7.9; Logic: True; Gate Type: AND; VCC(Min)(V): 2; Input Type: CMOS; Voltage(Nom)(V): 3.3,5; Bits(#): 1; VCC(Max)(V): 5.5; F @ Nom Voltage(Max)(Mhz): 75; Rating: Catalog; 3-State Output: No; Operating Temperature Range(C): -55 to 125; DatasheetVersion: SCLS314N; Sub-Family: AND Gate; Output Type: CMOS; PackageReference: DCK0005A